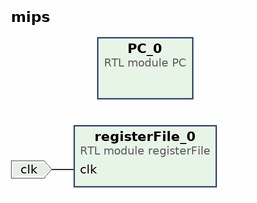
[diagram p0: block diagram of the top level]
# Vivado block design mips, xc7k70tfbv676-1, Vivado 2020.2
create_bd_design mips

create_bd_port -dir I clk

create_bd_cell -type module -reference registerFile registerFile_0
create_bd_cell -type module -reference PC PC_0

# ---- connections ----

connect_bd_net [get_bd_ports clk] [get_bd_pins registerFile_0/clk]

validate_bd_design
save_bd_design
